# EAGLE design CC1101_revc (EAGLE 7.7.0)

## Sheet 1 of 2
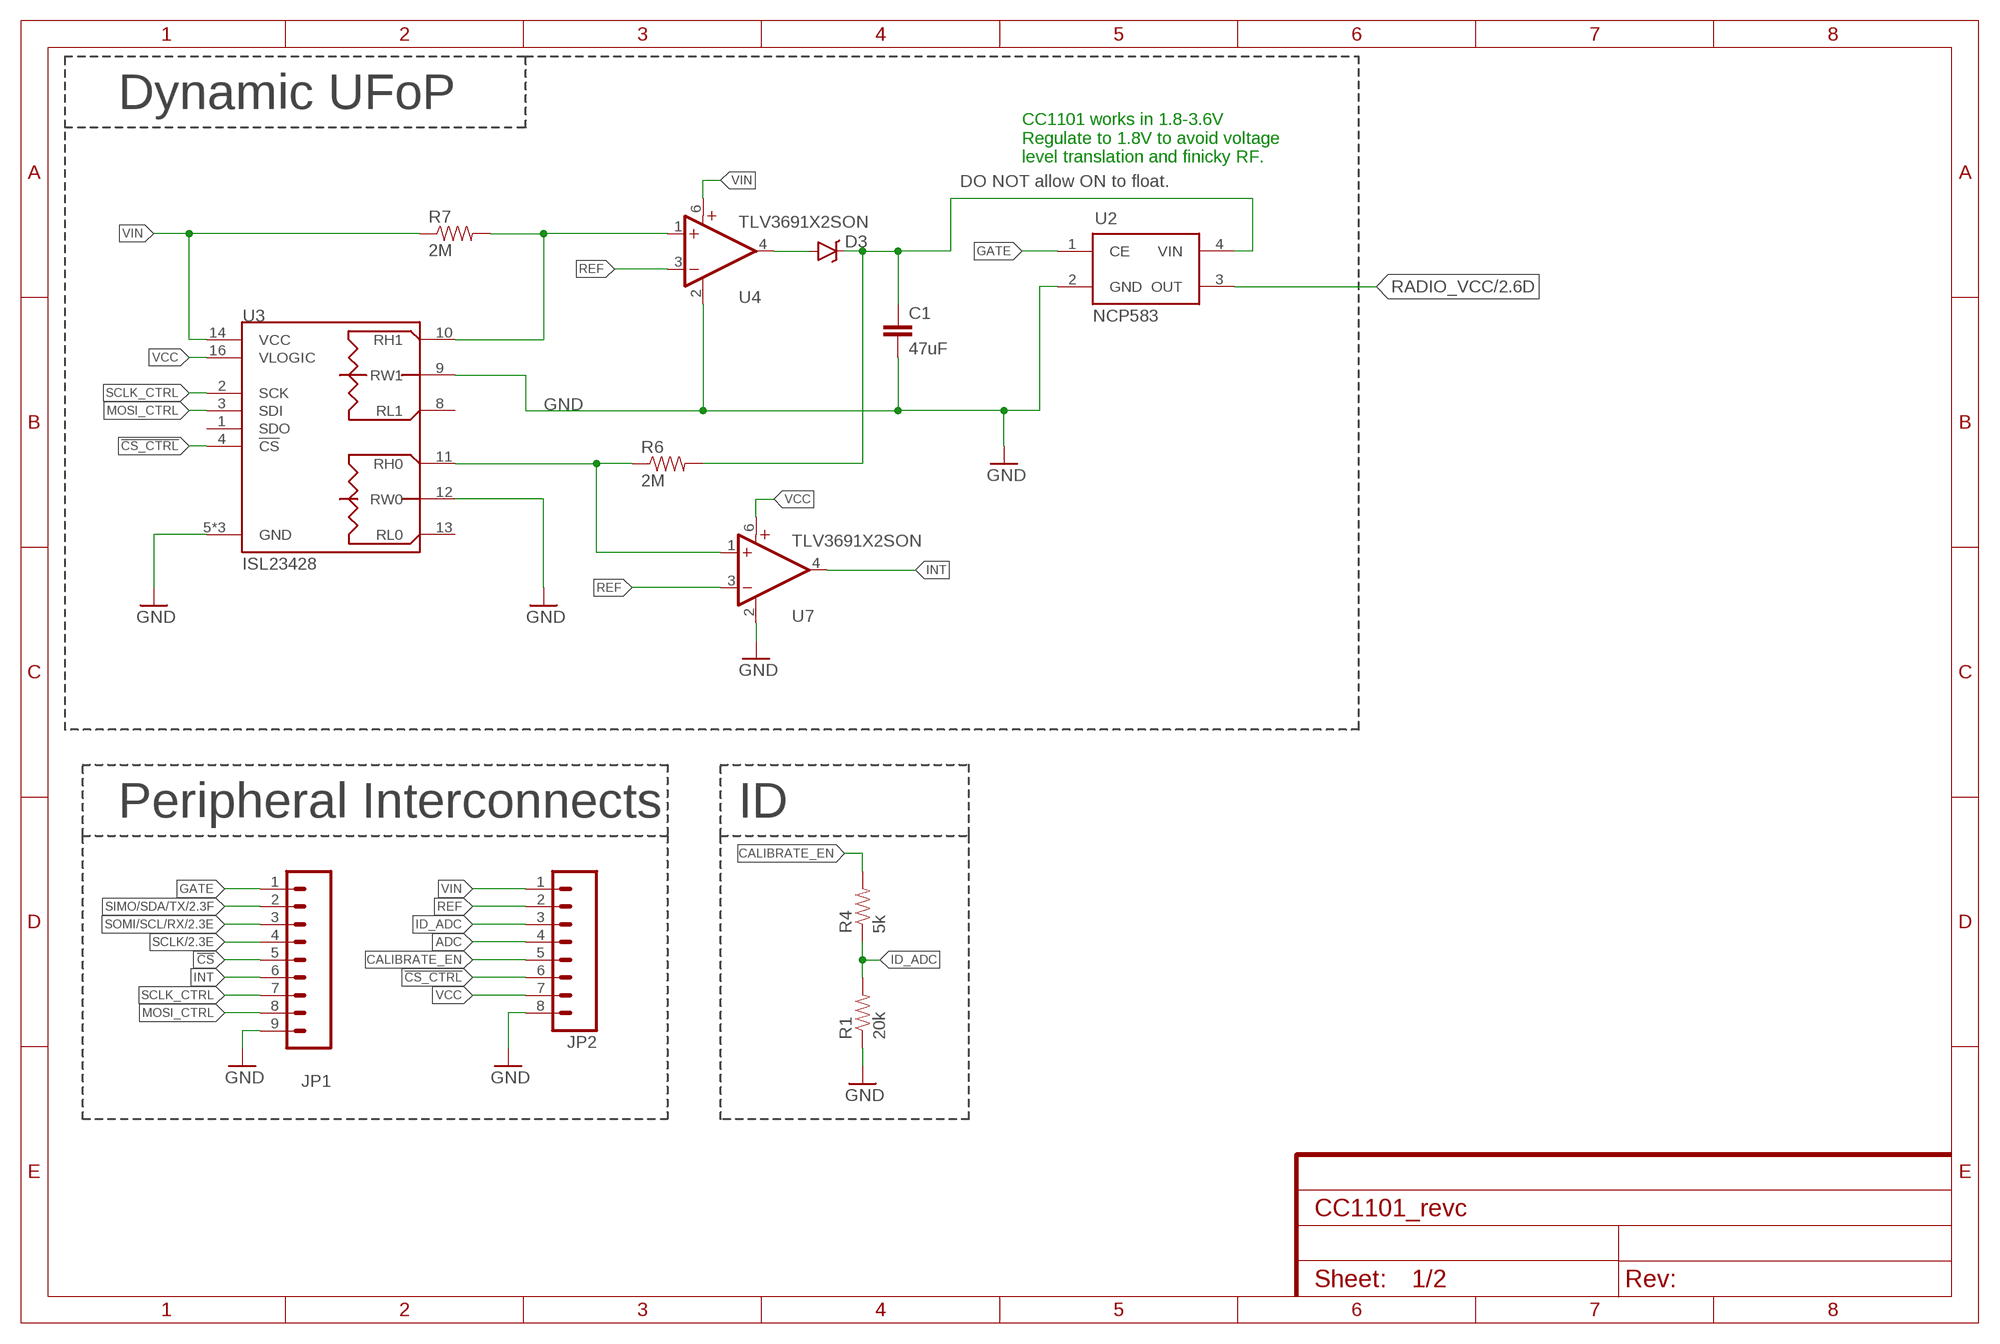
[diagram p0: schematic, sheet 1]
FRAME2 (FRAME-A4L): CNAME: CC1101 Radio Peripheral; CREVISION: C; DESIGNER: Josiah Hester

### Parts
C1  47uF  CAP1206  [1206]
D3  RB751  DIODE-SCHOTTKY-RB751  [SOD-523]
JP1  M091.27MM  [1X09-1.27MM]
JP2  M081.27MM  [1X08-1.27MM]
R1  20k  R-EU  [0402]
R4  5k  R-EU  [0402]
R6  2M  R-EU  [0402]
R7  2M  R-EU  [0402]
U2  NCP583  [SC82-AB_1PRIMARY]
U3  ISL23428  [UTQFN-16]
U4  TLV3691X2SON  [X2SON]
U7  TLV3691X2SON  [X2SON]

### Nets
!CS: JP1.5 ; also sheet 2
!CS_CTRL: JP2.6 U3.4(!CS)
ADC: JP2.4
CALIBRATE_EN: JP2.5 R4.2
GATE: JP1.1 U2.1(CE)
GND: C1.2 JP1.9 JP2.8 R1.1 U2.2(GND) U3.5(GND) U3.6(GND) U3.9(RW1) U3.12(RW0) U3.15(GND) U4.2(GND) U7.2(GND) ; also sheet 2
ID_ADC: JP2.3 R1.2 R4.1
INT: JP1.6 U7.4(OUT)
MOSI_CTRL: JP1.8 U3.3(SDI)
N$12: R7.2 U3.10(RH1) U4.1(+IN)
N$14: R6.1 U3.11(RH0) U7.1(+IN)
N$16: D3.A U4.4(OUT)
PERIPH_VCC: C1.1 D3.C R6.2 U2.4(VIN)
RADIO_VCC: U2.3(OUT) ; also sheet 2
REF: JP2.2 U4.3(-IN) U7.3(-IN)
SCLK: JP1.4 ; also sheet 2
SCLK_CTRL: JP1.7 U3.2(SCK)
SIMO/SDA/TX: JP1.2 ; also sheet 2
SOMI/SCL/RX: JP1.3 ; also sheet 2
VCC: JP2.7 U3.16(VLOGIC) U7.6(V+)
VIN: JP2.1 R7.1 U3.14(VCC) U4.6(V+)
Unconnected: U3.1(SDO) U3.8(RL1) U3.13(RL0)

### Notes on the sheet
- Dynamic UFoP
- CC1101 works in 1.8-3.6V
  Regulate to 1.8V to avoid voltage
  level translation and finicky RF.
- DO NOT allow ON to float.
- Peripheral Interconnects | ID

## Sheet 2 of 2
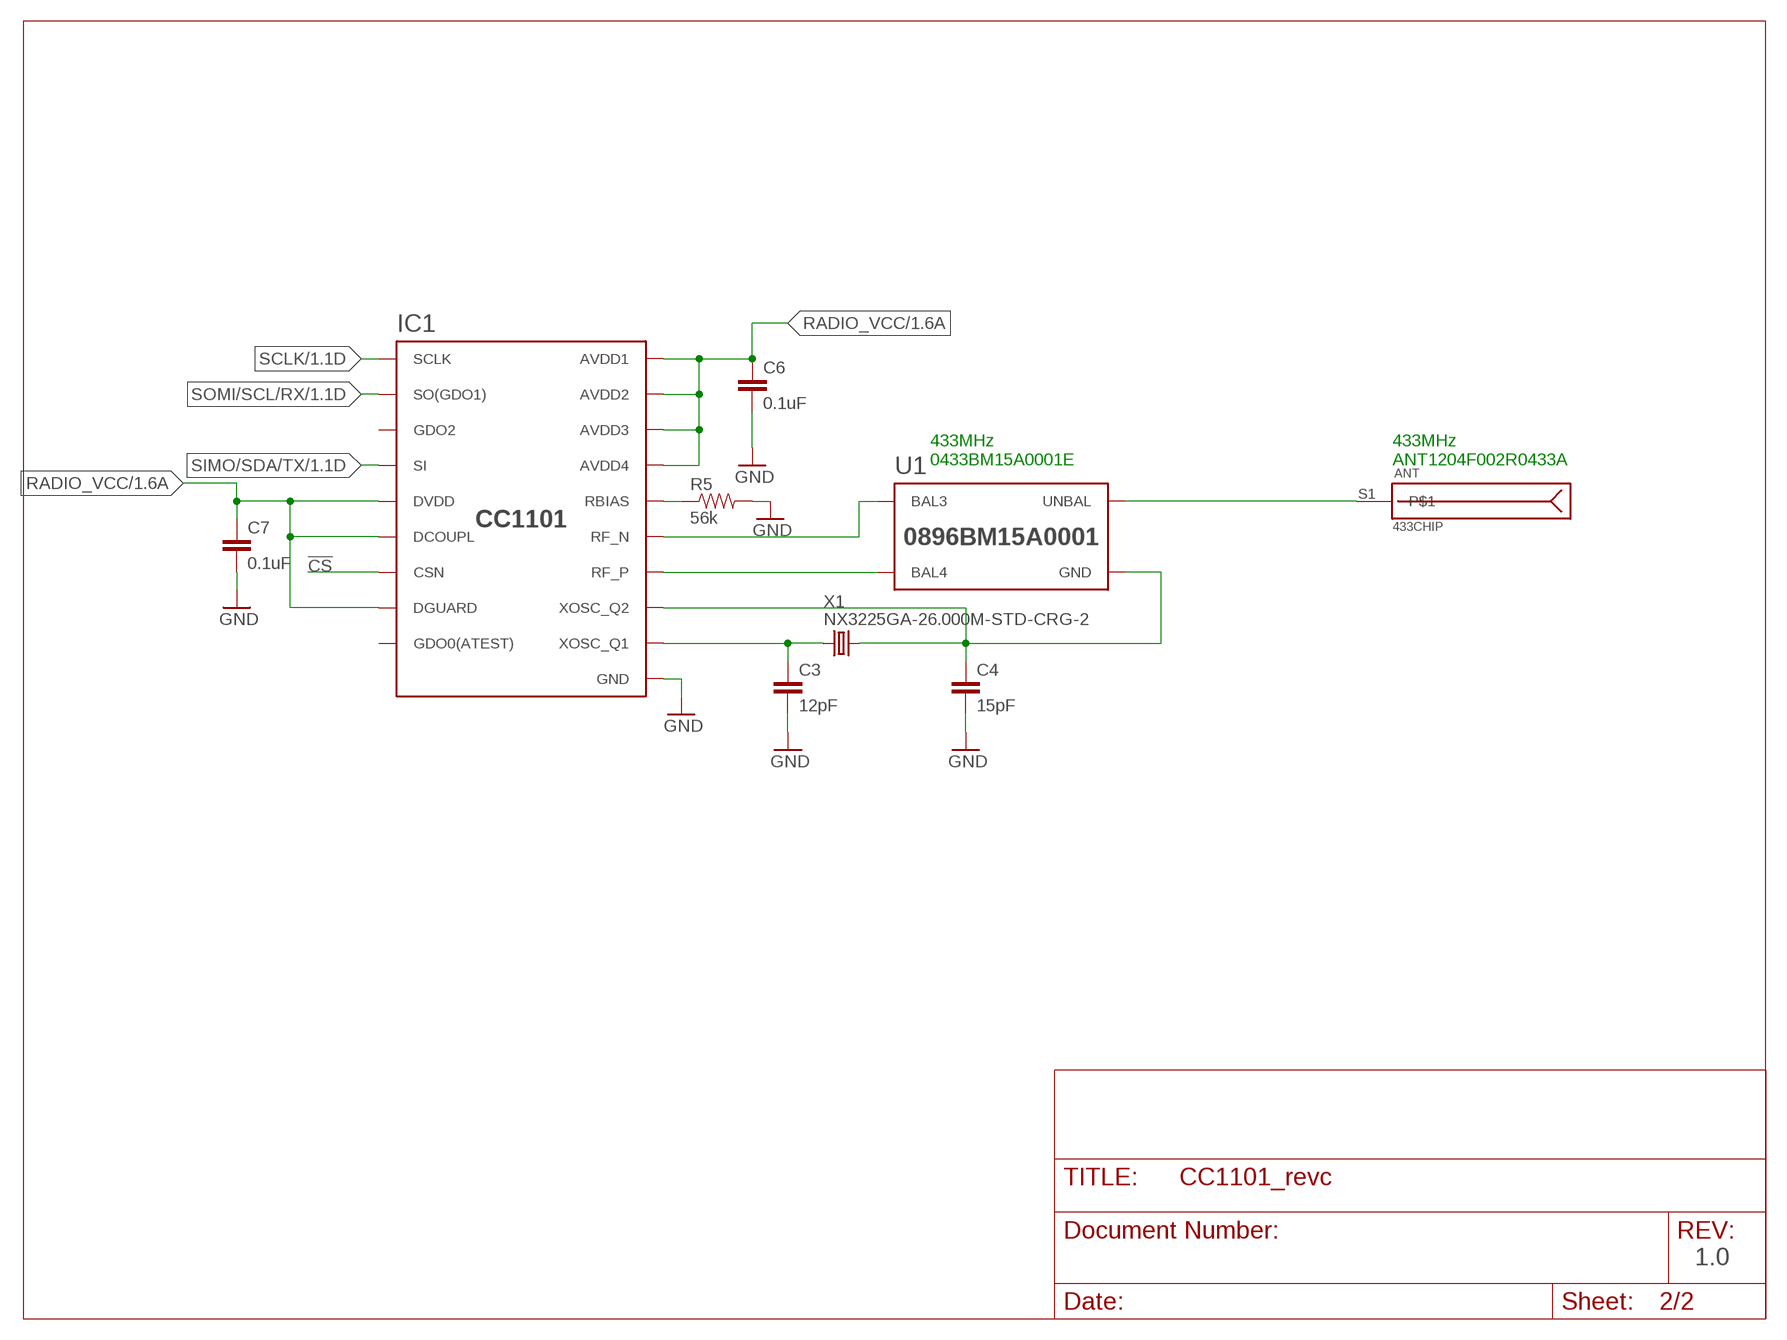
[diagram p1: schematic, sheet 2]

### Parts
ANT  433CHIP  [ANT-433-USP]
C3  12pF  C-EU0603  [0603]
C4  15pF  C-EU0603  [0603]
C6  0.1uF  C-EU0603  [0603]
C7  0.1uF  C-EU0603  [0603]
IC1  CC1101  [QLP20]
R5  56k  R-EU0603  [0603]
U1  0896BM15A0001  [0896BM15A0001]
X1  NX3225GA-26.000M-STD-CRG-2  XTAL-3.2X2.5  [XTAL-3.2X2.5]

### Nets
!CS: IC1.7(CSN) ; also sheet 1
GND: C3.2 C4.2 C6.2 C7.2 IC1.16(GND) IC1.19(GND) IC1.GND R5.2 ; also sheet 1
N$1: IC1.12(RF_P) U1.4(BAL4)
N$3: IC1.13(RF_N) U1.3(BAL3)
N$6: C3.1 IC1.8(XOSC_Q1) X1.1
N$7: IC1.17(RBIAS) R5.1
N$15: ANT.S1 U1.1(UNBAL)
RADIO_VCC: C6.1 C7.1 IC1.4(DVDD) IC1.5(DCOUPL) IC1.9(AVDD1) IC1.11(AVDD2) IC1.14(AVDD3) IC1.15(AVDD4) IC1.18(DGUARD) ; also sheet 1
SCLK: IC1.1(SCLK) ; also sheet 1
SIMO/SDA/TX: IC1.20(SI) ; also sheet 1
SOMI/SCL/RX: IC1.2(SO(GDO1)) ; also sheet 1
XOSC_Q2: C4.1 IC1.10(XOSC_Q2) U1.2(GND) U1.5(GND) U1.6(GND) X1.3
Unconnected: IC1.3(GDO2) IC1.6(GDO0(ATEST))

### Notes on the sheet
- 433MHz
  0433BM15A0001E
- 433MHz
  ANT1204F002R0433A
- 1.0

## Library data of the parts
ANT = HF-Bauteile:433CHIP; MPN: ANT1204F002R0433A
C1 = SparkFun-Capacitors:CAP: Capacitor Standard 0603 ceramic capacitor, and 0.1" leaded capacitor.; DIGIKEY: 490-3907-1-ND; MPN: GRM31CR60J476ME19L
C3 = tiny_passives:C-EU; MPN: 06035A120FAT2A
C4 = tiny_passives:C-EU; MPN: C1608C0G1H150J080AA
C6 C7 = tiny_passives:C-EU; MPN: GCJ188R71H104KA12D
D3 = SparkFun-DiscreteSemi:DIODE-SCHOTTKY: Schottky diodes in SFE's production catalog BAT20J 1A 23V 0.62Vf RB751 120mA 40V 0.37Vf PMEG4005EJ 0.5A 40V 0.42Vf MBRA140 1A 40V 0.5Vf B340A 3A 40V SMA; DIGIKEY: BAS40-02V-V-G-08GICT-ND; MPN: RB751S40T1G; PROD_ID: DIO-11018
IC1 = cc1101:CC1101; MPN: CC1101RGP
JP1 = SparkFun-Connectors:M09: Header 9 Standard 9-pin 0.1" header. Use with straight break away headers (SKU : PRT-00116), right angle break away headers (PRT-00553), swiss pins (PRT-00743), machine pins (PRT-00117), and female headers (PRT-00115).; MPN: GRPB091VWVN-RC
JP2 = SparkFun-Connectors:M08: Header 8 Standard 8-pin 0.1" header. Use with straight break away headers (SKU : PRT-00116), right angle break away headers (PRT-00553), swiss pins (PRT-00743), machine pins (PRT-00117), and female headers (PRT-00115).; MPN: GRPB081VWVN-RC
R1 = tiny_passives:R-EU; MPN: ERJ-2RKF2002X
R4 = tiny_passives:R-EU; MPN: ERJ-2RKF4991X
R5 = tiny_passives:R-EU; MPN: ERJ-3GEYJ563V
R6 R7 = tiny_passives:R-EU; DIGIKEY: 1276-4293-1-ND; MPN: RC1005F205CS
U1 = otternet:0896BM15A0001; MPN: 0433BM15A0001E
U2 = ncp583:NCP583: NCP583 - Ultra-Low Iq 150 mA CMOS LDO Regulator with Enable The NCP583 series of low dropout regulators are designed for portable battery powered applications which require precise output voltage accuracy and low quiescent current. These devices feature an enable function which lowers current consumption significantly and are offered in two small packages; SC−82AB and the SOT−563. A 1.0 mF ceramic capacitor is the recommended value to be used with these devices on the output pin.; DIGIKEY: NCP583SQ18T1GOSCT-ND; MPN: NCP583SQ18T1G; PARTNUMBER: NCP583SQ18T1G
U3 = isl23428:ISL23428: Intersil: Dual, 128-Tap, Low Voltage Digitally Controlled Potentiometer The ISL23428 is a volatile, low voltage, low noise, low power, 128-tap, dual digitally controlled potentiometer (DCP) with an SPI Bus™ interface. It integrates two DCP cores, wiper switches and control logic on a monolithic CMOS integrated circuit. Each digitally controlled potentiometer is implemented with a combination of resistor elements and CMOS switches. The position of the wipers are controlled by the user through the SPI bus interface. Each potentiometer has an associated volatile Wiper Register (WRi, i = 0, 1) that can be directly written to and read by the user. The contents of the WRi controls the position of the wiper. When powered on, the wiper of each DCP will always commence at mid-scale (64 tap position). The low voltage, low power consumption, and small package of the ISL23428 make it an ideal choice for use in battery operated equipment. In addition, the ISL23428 has a VLOGIC pin allowing down to 1.2V bus operation, independent from the VCC value. This allows for low logic levels to be connected directly to the ISL23428 without passing through a voltage level shifter. The DCP can be used as a three-terminal potentiometer or as a two-terminal variable resistor in a wide variety of applications including control, parameter adjustments, and signal processing; DIGIKEY: ISL23428TFRUZ-T7ACT-ND; MPN: ISL23428TFRUZ-T7A
U4 U7 = tlv3691:TLV3691: 0.9-V to 6.5-V, Nanopower Comparator Datasheets Analog Signal Chain Guide <http://www.ti.com/lit/pdf/slyb174> TLV3691 <http://www.ti.com/lit/ds/symlink/tlv3691.pdf> Manufacturer Product Page TLV3691IDPFR Specifications <http://www.ti.com/general/docs/suppproductinfo.tsp?distId=10&orderablePartNumber=TLV3691IDPFR> Standard Package <javascript:dlgHelp('Standard%20Packaging%20Help');> 1 Category Integrated Circuits (ICs) </product-search/en/integrated-circuits-ics> Family Linear - Comparators </product-search/en/integrated-circuits-ics/linear-comparators/2556221> Series - Packaging <javascript:dlgHelp('Standard%20Packaging%20Help');> Cut Tape (CT) <javascript:dlgHelp('Cut%20Tape%20Help');> Type General Purpose Number of Elements 1 Output Type Push-Pull Voltage - Supply, Single/Dual (±) 0.9 V ~ 6.5 V, ±0.45 V ~ 3.25 V Voltage - Input Offset (Max) 3mV Current - Input Bias (Max) 100pA Current - Output (Typ) 42mA Current - Quiescent (Max) 150nA CMRR, PSRR (Typ) - Propagation Delay (Max) 35µs Hysteresis - Operating Temperature -40°C ~ 125°C Package / Case 6-XFDFN Mounting Type Surface Mount Supplier Device Package 6-X2SON (1x1) Online Catalog Comparators - 1 element </catalog/en/partgroup/comparators-1-element/3112?mpart=TLV3691IDPFR&vendor=296&WT.z_ref_page_type=PS&WT.z_ref_page_sub_type=PD&WT.z_ref_page_id=PD&WT.z_ref_page_event=DC_Link_Table> Other Names 296-37242-1; DIGIKEY: 296-37242-1-ND; MPN: TLV3691IDPFR
X1 = cc1101:XTAL; MPN: NX3225GA-26.000M-STD-CRG-2

## Net classes
1 Ground: width 0.203 mm, drill 0.61 mm

## Board
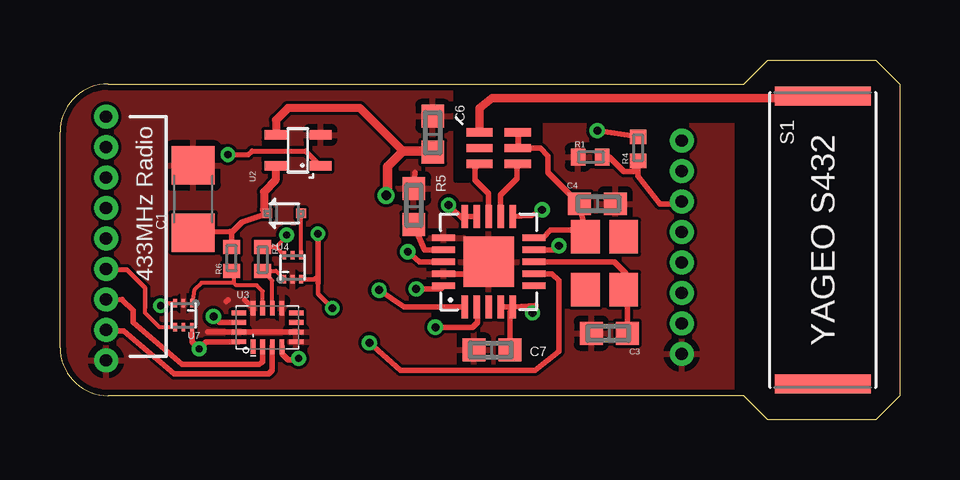
[diagram p2: board, top side]
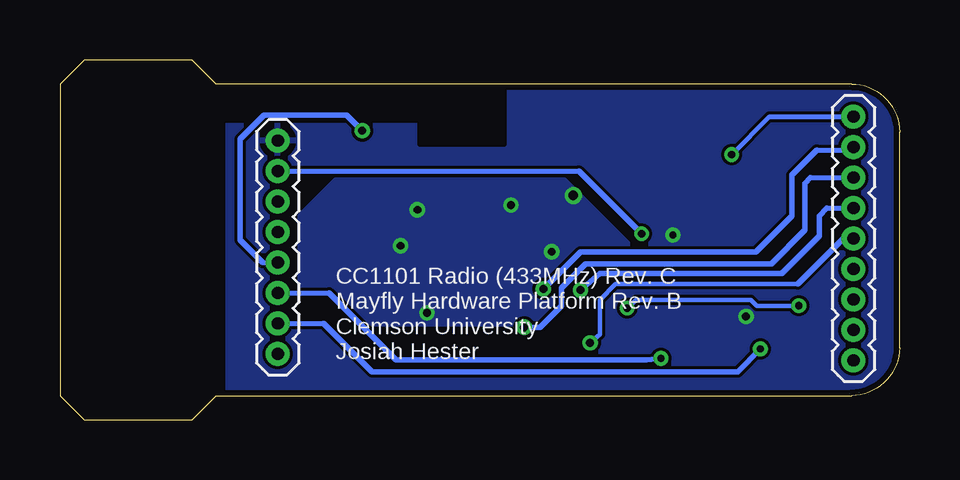
[diagram p3: board, bottom side, seen from below]

Size 35 x 15 mm. Coordinates in mm from the lower left corner, seen from the top.
Outline: 2,14 28.5,14 29.5,15 34,15 35,14 35,1 34,0 29.5,0 28.5,1 2,1 arc-90 0,3 0,12 arc-90 2,14
Copper layers (1*16): Top 0.035mm / dielectric 1.5mm / Bottom 0.035mm
Design rules "MF_Standard_2_Layer": minimum track width 5mil, minimum drill 12mil, track to track 5mil, track to pad 5mil, pad to pad 5mil, via to via 5mil, smd to smd 0mil, copper to edge 10mil, drill to drill 10mil, minimum pad ring 6mil, minimum via ring 6mil, stop-mask expansion 2mil, vias tented up to drill 25mil, thermal gap 10mil

### Footprints (pad centres in the part's own frame; a part is rotated, then mirrored left to right if it is on the bottom)
ANT-433-USP = smd 0.8 x 4: P$4 6,0; S1 -6,0
1206 = smd 1.6 x 1.8: 1 -1.4,0; 2 1.4,0
0603 = smd 0.95 x 0.95: 1 -0.75,0; 2 0.75,0
SOD-523 = smd 0.4 x 0.4: A -0.7,0; C 0.7,0
QLP20 = smd 0.96 x 0.28: 1 -1.88,1; 2 -1.88,0.5; 3 -1.88,0; 4 -1.88,-0.5; 5 -1.88,-1; 11 1.88,-1; 12 1.88,-0.5; 13 1.88,0; 14 1.88,0.5; 15 1.88,1 | smd 0.28 x 0.96: 6 -1,-1.88; 7 -0.5,-1.88; 8 0,-1.88; 9 0.5,-1.88; 10 1,-1.88; 16 1,1.88; 17 0.5,1.88; 18 0,1.88; 19 -0.5,1.88; 20 -1,1.88 | smd 2.1 x 2.1: GND 0,0
1X09-1.27MM = drill 0.508 pad 1: 1 0,0; 2 1.27,0; 3 2.54,0; 4 3.81,0; 5 5.08,0; 6 6.35,0; 7 7.62,0; 8 8.89,0; 9 10.16,0
1X08-1.27MM = drill 0.508 pad 1: 1 0,0; 2 1.27,0; 3 2.54,0; 4 3.81,0; 5 5.08,0; 6 6.35,0; 7 7.62,0; 8 8.89,0
0402 = smd 0.6 x 0.7: 1 -0.5,0; 2 0.5,0
0896BM15A0001 = smd 0.35 x 1.1: 1 0.65,0.8; 2 0,0.8; 3 -0.65,0.8; 4 -0.65,-0.8; 5 0,-0.8; 6 0.65,-0.8
SC82-AB_1PRIMARY = smd 0.406 x 0.914: 1 -0.621,-0.913; 2 0.675,-0.913; 3 0.675,0.967; 4 -0.621,0.967
UTQFN-16 = smd 0.2 x 0.6: 1 -0.6,-0.8; 2 -0.2,-0.8; 3 0.2,-0.8; 4 0.6,-0.8; 9 0.6,0.8; 10 0.2,0.8; 11 -0.2,0.8; 12 -0.6,0.8 | smd 0.6 x 0.2: 5 1.2,-0.6; 6 1.2,-0.2; 7 1.2,0.2; 8 1.2,0.6; 13 -1.2,0.6; 14 -1.2,0.2; 15 -1.2,-0.2; 16 -1.2,-0.6
X2SON = smd 0.152 x 0.35: 1 -0.35,-0.5; 2 0,-0.5; 3 0.35,-0.5; 4 0.35,0.5; 5 0,0.5; 6 -0.35,0.5
XTAL-3.2X2.5 = smd 1.4 x 1.2: 1 -1.1,-0.8; 2 1.1,-0.8; 3 1.1,0.8; 4 -1.1,0.8

### Placement (x,y rotation side)
ANT  31.8,7.49 270 top
C1  5.55,9.2 90 top
C3  22.9,3.6 180 top
C4  22.4,9 0 top
C6  15.54,11.91 90 top
C7  18.01,2.9 180 top
D3  9.35,8.6 180 top
IC1  17.87,6.58 90 top
JP1  1.92,12.63 270 bottom
JP2  25.92,11.63 270 bottom
R1  22.1,10.95 0 top
R4  24.1,11.3 90 top
R5  14.75,8.89 90 top
R6  7.15,6.7 90 top
R7  8.45,6.7 270 top
U1  18.29,11.32 90 top
U2  9.95,11.2 90 top
U3  8.65,3.85 0 top
U4  9.7,6.35 0 top
U7  5.15,4.35 180 top
X1  22.7,6.52 90 top

### Tracks (layer width: path | path; a pad name or v marks a point on that pad's centre or on a via)
!CS  (via drill 0.33)
  Top 0.222: IC1.7 20.52,6.08 20.8,5.8 20.8,2.85 19.8,2.05 14.2,2.05 v12.9,3.2
  Bottom 0.18: 12.75,3.05 v12.9,3.2 12.5,3.55 12.5,5 11.85,5.65 4.25,5.65
  Bottom 0.2: 2.35,7.55 JP1.5
  Bottom 0.222: 2.35,7.55 4.25,5.65
!CS_CTRL  (via drill 0.3)
  Top 0.22: U3.4 9.25,2.75 9.5,2.5 9.9,2.5 v9.95,2.55
  Bottom 0.2: JP2.6 23.78,5.28
  Bottom 0.222: 23.78,5.28 21,2.5 10.55,2.5 v9.95,2.55
CALIBRATE_EN  (via drill 0.33)
  Top 0.222: v22.4,12.05 R4.2
  Bottom 0.2: 26.55,6.55 JP2.5
  Bottom 0.222: 26.55,6.55 27.5,7.5 27.5,11.7 26.5,12.7 23.05,12.7 v22.4,12.05
GATE  (via drill 0.3)
  Top 0.2: v7,11.05 7.85,11.05 8,11.2 10.24,11.2 U2.1
  Bottom 0.18: 5.42,12.63 v7,11.05
  Bottom 0.2: 5.42,12.63 JP1.1
GND
  Top 0.222: R5.2 14.8,10.29 | IC1.19 17.58,6.08 18,6.5 | U3.6 U3.15 6.15,3.65 | U3.12 7.7,5 | 7,5 6.92,4.92
  pour Top: -0.5,1 28,1 28,14.5 -0.5,14.5
ID_ADC
  Top 0.2: 25.83,9 JP2.3
  Top 0.222: 25.83,9 25,9 24.1,10.15 R4.1 23.9,10.35 23.5,10.35 22.9,10.95 R1.2
INT
  Top 0.16: U7.4 4.15,3.85 3.55,4.45 3.55,4.65
  Top 0.18: 3.55,4.65 3.55,5.5 2.8,6.25
  Top 0.2: 2.8,6.25 1.95,6.25 JP1.6
MOSI_CTRL
  Top 0.2: 1.96,3.7 JP1.8
  Top 0.22: 4.9,1.9 4.75,1.9 2.65,3.7 1.96,3.7
  Top 0.222: 4.9,1.9 8.7,1.9 8.85,2.05 U3.3
N$1
  Top 0.222: IC1.12 18.37,9.37 19.05,10.05 19.05,10.63 U1.4
N$3
  Top 0.222: IC1.13 17.87,9.43 17.3,10 17.3,10.48 U1.3
N$6
  Top 0.222: C3.1 23.65,4.66 X1.1 23.6,5.51 23.6,6.1 23.12,6.58 IC1.8
N$7
  Top 0.222: IC1.17 15.2,7.08 R5.1
N$9
  cutout Top: 18,14 29,14 29,12.5 20,12.5 20,10 16.5,10 16.5,14
N$10
  cutout Bottom: 16.5,14 29,14 29,12.5 20,12.5 20,11.5 16.5,11.5
N$12
  Top 0.16: U4.1 9,6.2 R7.2 8.85,5.8 U3.10
N$14
  Top 0.16: U3.11 8.45,5.35 8.2,5.6 7.35,5.6 7.25,5.7 | 7.25,5.7 7.25,6.1 R6.1 | 7.25,5.7 5.9,5.7 5.6,5.4 U7.1
N$15
  Top 0.35: U1.1 17.49,12.99 18,13.4 31.79,13.4 ANT.S1
N$16
  Top 0.16: U4.4 D3.A
PERIPH_VCC
  Top 0.222: D3.C 7.6,8.25 7.15,7.8 | R6.2 7.15,7.8 | C1.1 7.1,7.85 7.15,7.8
  Top 0.333: U2.4 8.98,9.98 8.5,9.5 8.5,8.75 D3.C
RADIO_VCC  (via drill 0.33, 0.4)
  Top 0.222: v16.2,8.95 16.87,8.3 IC1.15 | IC1.15 IC1.14 | IC1.18 14.98,6.58 v14.5,7 | IC1.11 19.66,8.51 v20.1,8.75 | IC1.4 IC1.5 | IC1.5 19.85,4.75 v19.7,4.45 | C7.1 18.76,4.49 IC1.5 | 16.9,8.29 IC1.15 | IC1.9 20.77,7.08 v20.8,7.25 | 15.38,11.2 C6.1
  Top 0.333: 14.3,11.2 12.5,13 9.5,13 9,12.5 9,11.89 U2.3
  Top 0.39: 15.38,11.2 14.3,11.2 13.65,10.55 13.65,9.4 v13.6,9.35
  pour Bottom: 14,10 23.5,10 25,8.5 25,5 24,4 11.5,4 11,4.5 11,7
REF  (via drill 0.3)
  Top 0.18: U7.3 4.3,4.85 v4.2,4.75 | 10.75,5.7 10.75,5.25 v11.35,4.65 | U4.3 10.6,5.85 10.75,6
  Top 0.222: v10.75,7.75 10.75,6 10.75,5.7
  Bottom 0.18: v4.2,4.75 5.95,4.75 6.2,5 11,5 v11.35,4.65
  Bottom 0.2: JP2.2 13.36,10.36
  Bottom 0.222: 13.36,10.36 v10.75,7.75
SCLK  (via drill 0.33)
  Top 0.222: IC1.1 15.2,4.7 14.8,4.7 14.35,4.7 v13.3,5.4
  Bottom 0.2: 3.03,8.82 JP1.4
  Bottom 0.222: 3.03,8.82 3.35,8.5 3.35,7.65 4.9,6.1 12.5,6.1 v13.3,5.4
SCLK_CTRL
  Top 0.2: 2.6,5 JP1.7
  Top 0.22: 2.59,5.01 2.6,5
  Top 0.222: 2.6,5 3.05,4.55 3.05,4.05 5.1,2.3 8.3,2.3 8.45,2.4 U3.2
SIMO/SDA/TX  (via drill 0.33)
  Top 0.222: 15.98,5.6 IC1.20 15.86,5.45 v14.85,5.45
  Bottom 0.2: 3.45,11.25 2.03,11.25 JP1.2
  Bottom 0.222: 3.45,11.25 4.5,10.2 4.5,8.5 6,7 13.3,7 v14.85,5.45
SOMI/SCL/RX  (via drill 0.33)
  Top 0.222: v15.65,3.85 17.2,3.85 17.4,4.05 17.4,4.68 IC1.2
  Bottom 0.2: 3.71,10.09 JP1.3
  Bottom 0.222: 3.71,10.09 3.95,9.85 3.95,7.9 5.35,6.5 13.1,6.5 14.1,5.5 14.1,4.75 15,3.85 v15.65,3.85
VCC  (via drill 0.3)
  Top 0.18: U7.6 5.5,3.6
  Top 0.22: U3.16 6.1,3.25 v5.8,2.95 5.5,3.25 5.5,3.6
  Bottom 0.2: JP2.7 24.01,4.01
  Bottom 0.22: 7,2 6.75,2 v5.8,2.95
  Bottom 0.222: 24.01,4.01 22,2 7,2
VIN  (via drill 0.3, 0.33)
  Top 0.16: R7.1 9,7.2 | 9,7.2 U4.6 | v9.45,7.7 9.3,7.5 9,7.2
  Top 0.222: U3.14 6.65,4.05 v6.4,4.3
  pour Bottom (rank 2): 0,1 28,1 28,14.5 0,14.5
XOSC_Q2
  Top 0.222: IC1.10 20.13,7.58 20.45,7.9 21.62,7.9 X1.3 21.9,7.85 C4.1 20.35,10.3 20.35,11 20.03,11.32 U1.5
  Top 0.254: U1.6 U1.5

### Text on the board
tPlace: 433MHz Radio
bPlace: CC1101 Radio (433MHz) Rev. C / Mayfly Hardware Platform Rev. B / Clemson University / Josiah Hester